# Altium project vestibular_vampire.PrjPcb (part 1 of 3)
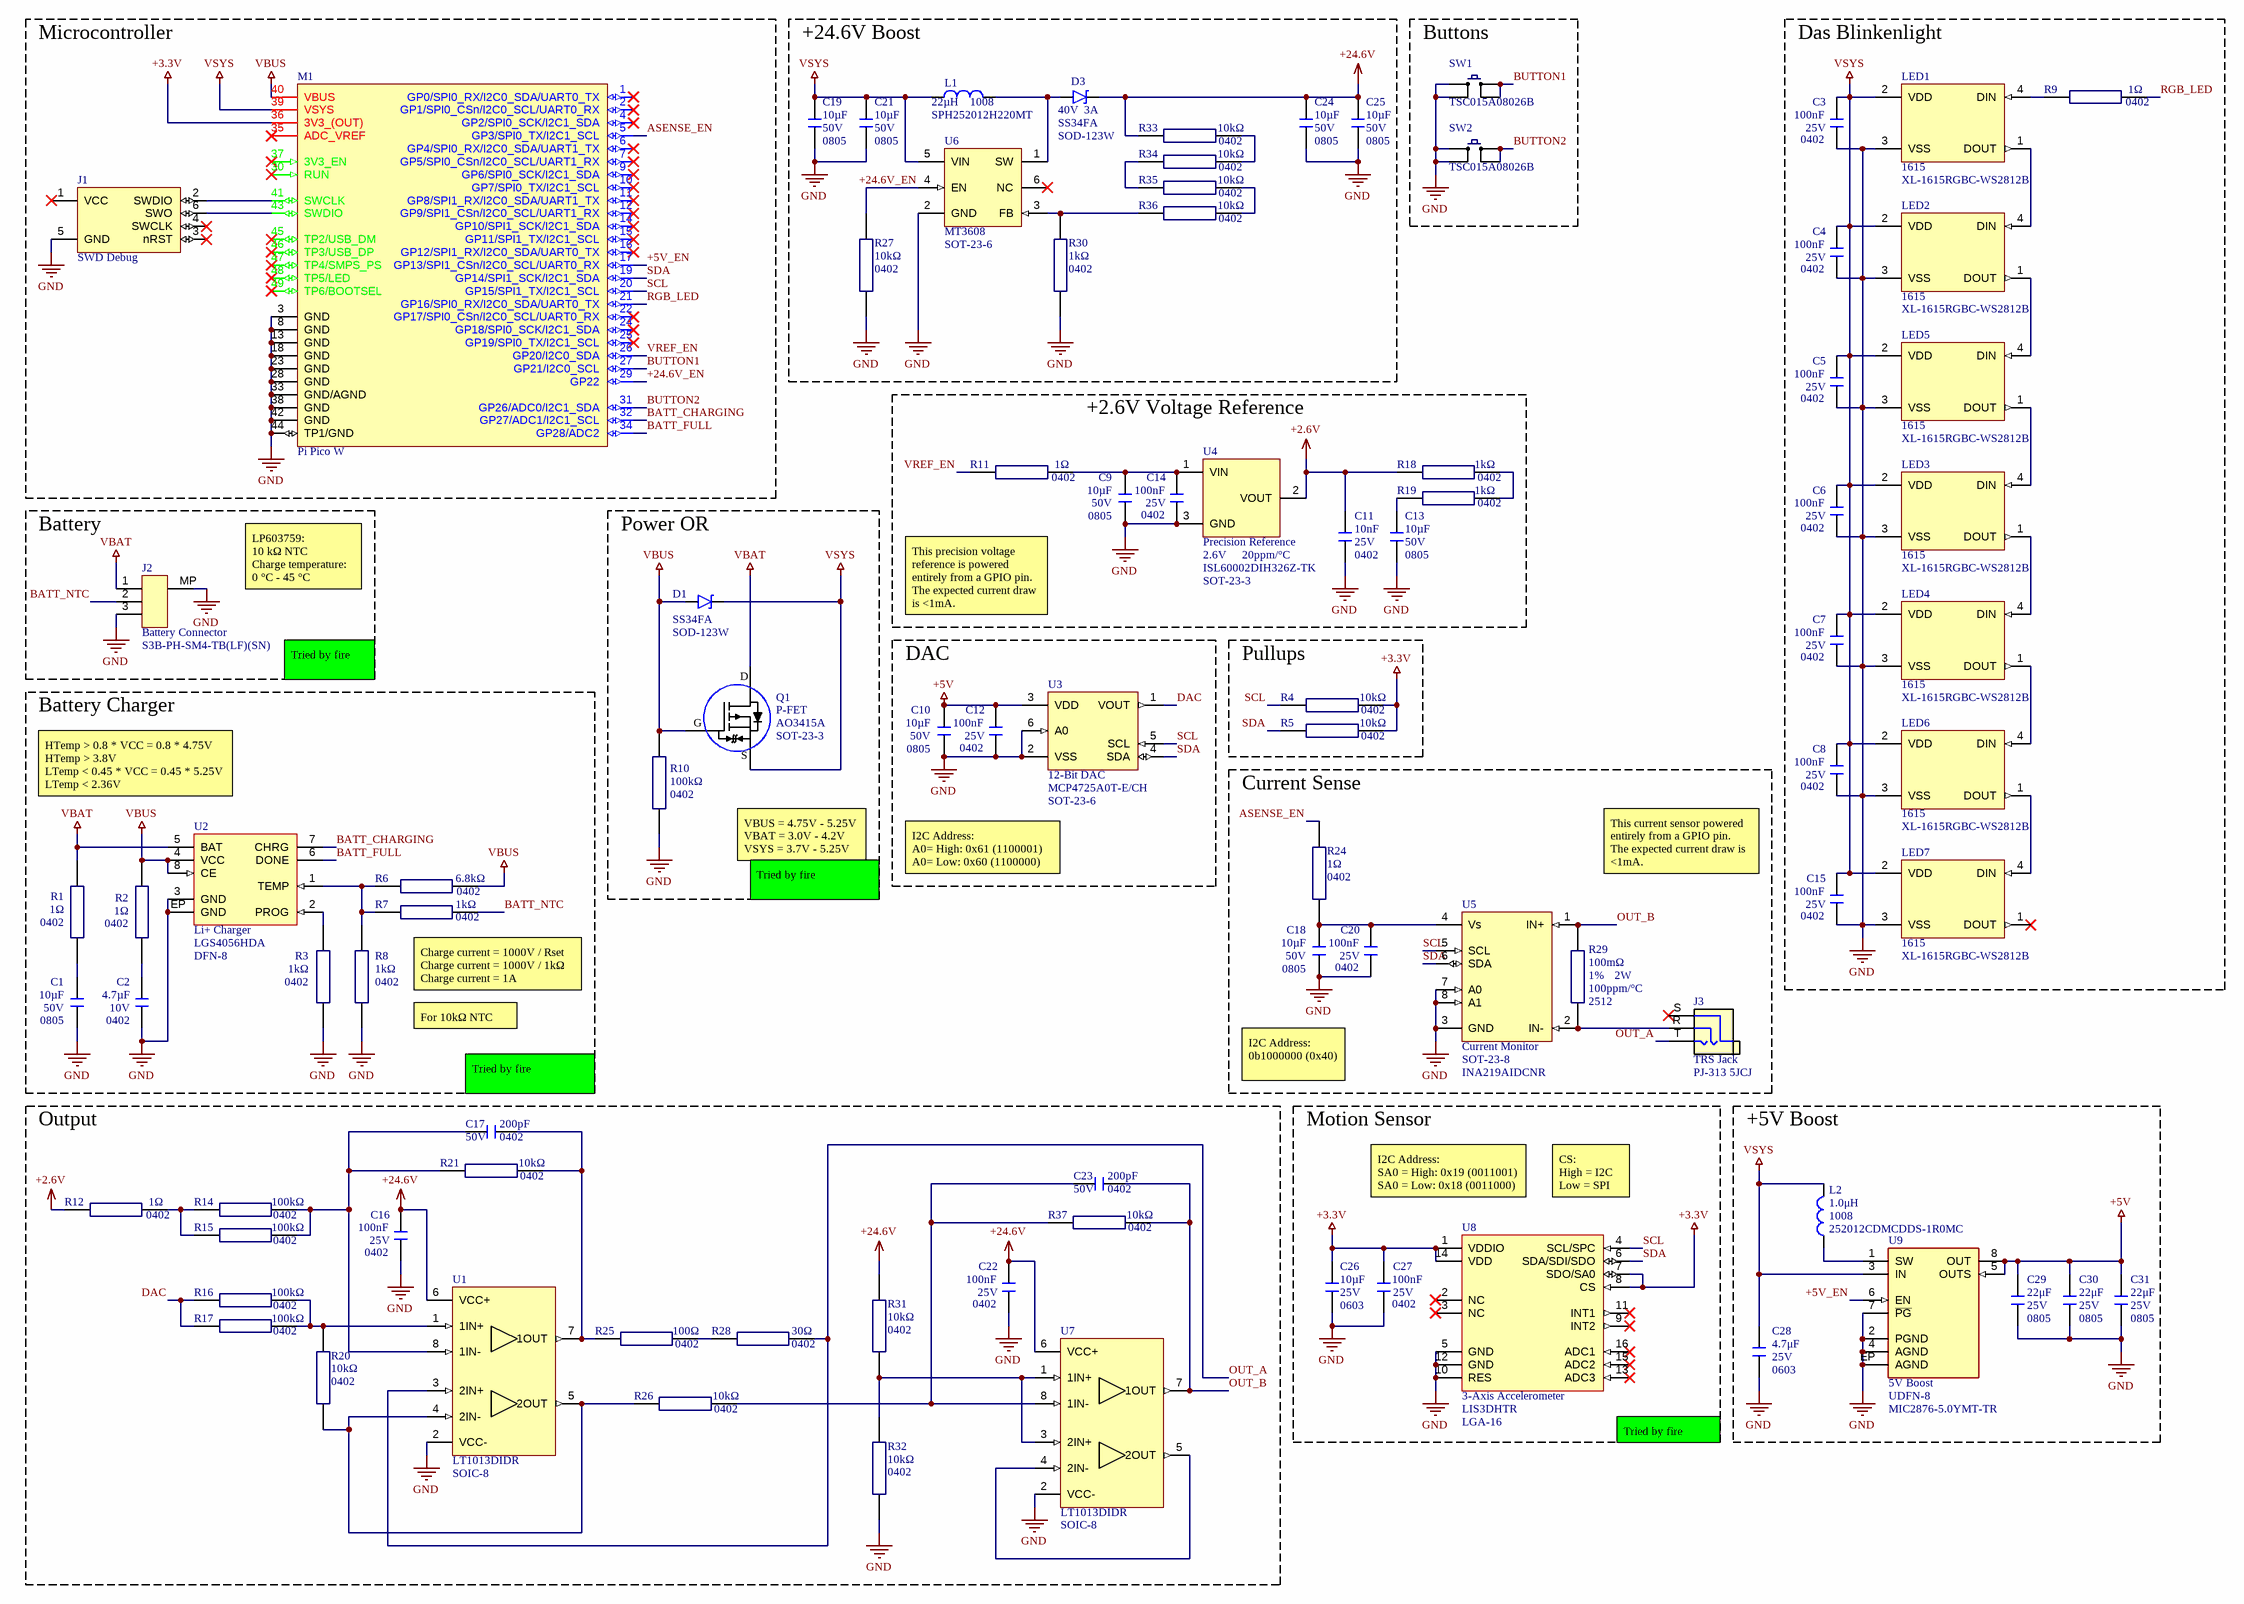
[diagram p0: vestibular_vampire.SchDoc]
Client: Entropic Engineering; Project: Vestibular Vampire; Revision: 1.0
1 sheet, 92 parts. Net scope: global (net labels, ports and power ports of the same name join across sheets).
Board file: vestibular_vampire.PcbDoc

## Sheet vestibular_vampire.SchDoc: Vestibular Vampire
size 594 x 420 mm; SheetNumber: 1; SheetTotal: 1

### Parts
C1  value 10µF  Case/Package: 0805  Voltage Rating: 50V  [0805_capacitor]  (hidden comment: GRM21BR61H106KE43L)
C2  value 4.7µF  Voltage Rating: 10V  Case/Package: 0402  [0402_capacitor]  (hidden comment: CL05A475KP5NRNC)
C3  Case Code (Imperial): 0402  Voltage: 25V  Capacitance: 100nF  [0402_capacitor]  (hidden comment: GRM155R71E104KE14D)
C4  Case Code (Imperial): 0402  Voltage: 25V  Capacitance: 100nF  [0402_capacitor]  (hidden comment: GRM155R71E104KE14D)
C5  Case Code (Imperial): 0402  Voltage: 25V  Capacitance: 100nF  [0402_capacitor]  (hidden comment: GRM155R71E104KE14D)
C6  Case Code (Imperial): 0402  Voltage: 25V  Capacitance: 100nF  [0402_capacitor]  (hidden comment: GRM155R71E104KE14D)
C7  Case Code (Imperial): 0402  Voltage: 25V  Capacitance: 100nF  [0402_capacitor]  (hidden comment: GRM155R71E104KE14D)
C8  Case Code (Imperial): 0402  Voltage: 25V  Capacitance: 100nF  [0402_capacitor]  (hidden comment: GRM155R71E104KE14D)
C9  value 10µF  Case/Package: 0805  Voltage Rating: 50V  [0805_capacitor]  (hidden comment: GRM21BR61H106KE43L)
C10  value 10µF  Case/Package: 0805  Voltage Rating: 50V  [0805_capacitor]  (hidden comment: GRM21BR61H106KE43L)
C11  Capacitance: 10nF  Voltage Rating: 25V  Case Code (Imperial): 0402  [0402_capacitor]  (hidden comment: CL05B103KA5NNNC)
C12  Case Code (Imperial): 0402  Voltage: 25V  Capacitance: 100nF  [0402_capacitor]  (hidden comment: GRM155R71E104KE14D)
C13  value 10µF  Case/Package: 0805  Voltage Rating: 50V  [0805_capacitor]  (hidden comment: GRM21BR61H106KE43L)
C14  Case Code (Imperial): 0402  Voltage: 25V  Capacitance: 100nF  [0402_capacitor]  (hidden comment: GRM155R71E104KE14D)
C15  Case Code (Imperial): 0402  Voltage: 25V  Capacitance: 100nF  [0402_capacitor]  (hidden comment: GRM155R71E104KE14D)
C16  Case Code (Imperial): 0402  Voltage: 25V  Capacitance: 100nF  [0402_capacitor]  (hidden comment: GRM155R71E104KE14D)
C17  value 200pF  Voltage Rating: 50V  Case/Package: 0402  [0402_capacitor]  (hidden comment: GRT1555C1H201FA02D)
C18  value 10µF  Case/Package: 0805  Voltage Rating: 50V  [0805_capacitor]  (hidden comment: GRM21BR61H106KE43L)
C19  value 10µF  Case/Package: 0805  Voltage Rating: 50V  [0805_capacitor]  (hidden comment: GRM21BR61H106KE43L)
C20  Case Code (Imperial): 0402  Voltage: 25V  Capacitance: 100nF  [0402_capacitor]  (hidden comment: GRM155R71E104KE14D)
C21  value 10µF  Case/Package: 0805  Voltage Rating: 50V  [0805_capacitor]  (hidden comment: GRM21BR61H106KE43L)
C22  Case Code (Imperial): 0402  Voltage: 25V  Capacitance: 100nF  [0402_capacitor]  (hidden comment: GRM155R71E104KE14D)
C23  value 200pF  Voltage Rating: 50V  Case/Package: 0402  [0402_capacitor]  (hidden comment: GRT1555C1H201FA02D)
C24  value 10µF  Case/Package: 0805  Voltage Rating: 50V  [0805_capacitor]  (hidden comment: GRM21BR61H106KE43L)
C25  value 10µF  Case/Package: 0805  Voltage Rating: 50V  [0805_capacitor]  (hidden comment: GRM21BR61H106KE43L)
C26  value 10µF  Case/Package: 0603  Voltage Rating: 25V  [0603_capacitor]  (hidden comment: CL10A106MA8NRNC)
C27  Case Code (Imperial): 0402  Voltage: 25V  Capacitance: 100nF  [0402_capacitor]  (hidden comment: GRM155R71E104KE14D)
C28  value 4.7μF  Case/Package: 0603  Voltage Rating: 25V  [0603_capacitor]  (hidden comment: C1608X5R1E475K080AC)
C29  value 22μF  Rated DC Voltage (URdc): 25V  Case/Package: 0805  [0805_capacitor]  (hidden comment: GRT21BR61E226ME13L)
C30  value 22μF  Rated DC Voltage (URdc): 25V  Case/Package: 0805  [0805_capacitor]  (hidden comment: GRT21BR61E226ME13L)
C31  value 22μF  Rated DC Voltage (URdc): 25V  Case/Package: 0805  [0805_capacitor]  (hidden comment: GRT21BR61E226ME13L)
D1  Case/Package: SOD-123W  [SOD-123]  (hidden comment: SS34FA)
D3  Average Rectified Current: 3A  Max Reverse Voltage (DC): 40V  Case/Package: SOD-123W  [SOD-123]  (hidden comment: SS34FA)
J1  SWD Debug  [debug_header_dual]  (no BOM)
J2  Battery Connector  [S3B-PH-SM4-TB]
J3  TRS Jack  [pj-313_5jcj_3.5mm_trs_jack]
L1  value 22µH  Case/Package: 1008  [INDC2520X12N]  (hidden comment: SPH252012H220MT)
L2  value 1.0μH  Package: 1008  [INDC2520X12N]  (hidden comment: 252012CDMCDDS-1R0MC)
LED1  Package: 1615  [XL-1615RGBC-WS2812B]  (hidden comment: WS2812B)
LED2  Package: 1615  [XL-1615RGBC-WS2812B]  (hidden comment: WS2812B)
LED3  Package: 1615  [XL-1615RGBC-WS2812B]  (hidden comment: WS2812B)
LED4  Package: 1615  [XL-1615RGBC-WS2812B]  (hidden comment: WS2812B)
LED5  Package: 1615  [XL-1615RGBC-WS2812B]  (hidden comment: WS2812B)
LED6  Package: 1615  [XL-1615RGBC-WS2812B]  (hidden comment: WS2812B)
LED7  Package: 1615  [XL-1615RGBC-WS2812B]  (hidden comment: WS2812B)
M1  Pi Pico W  [pi_pico_w]
Q1  P-FET  Case/Package: SOT-23-3  [SOT95P280X115-3N]
R1  value 1Ω  Case/Package: 0402  [0402_resistor]  (hidden comment: 0402WGF100KTCE)
R2  value 1Ω  Case/Package: 0402  [0402_resistor]  (hidden comment: 0402WGF100KTCE)
R3  value 1kΩ  Case/Package: 0402  [0402_resistor]  (hidden comment: Rset)
R4  value 10kΩ  Case Code (Imperial): 0402  [0402_resistor]  (hidden comment: RC0402FR-0710KL)
R5  value 10kΩ  Case Code (Imperial): 0402  [0402_resistor]  (hidden comment: RC0402FR-0710KL)
R6  value 6.8kΩ  Case/Package: 0402  [0402_resistor]  (hidden comment: RC0402FR-076K8L)
R7  value 1kΩ  Case/Package: 0402  [0402_resistor]  (hidden comment: RC0402JR-071KL)
R8  value 1kΩ  Case/Package: 0402  [0402_resistor]  (hidden comment: Rset)
R9  value 1Ω  Case/Package: 0402  [0402_resistor]  (hidden comment: 0402WGF100KTCE)
R10  value 100kΩ  Case/Package: 0402  [0402_resistor]  (hidden comment: RC0402FR-07100KL)
R11  value 1Ω  Case/Package: 0402  [0402_resistor]  (hidden comment: 0402WGF100KTCE)
R12  value 1Ω  Case/Package: 0402  [0402_resistor]  (hidden comment: 0402WGF100KTCE)
R14  value 100kΩ  Case/Package: 0402  [0402_resistor]  (hidden comment: RC0402FR-07100KL)
R15  value 100kΩ  Case/Package: 0402  [0402_resistor]  (hidden comment: RC0402FR-07100KL)
R16  value 100kΩ  Case/Package: 0402  [0402_resistor]  (hidden comment: RC0402FR-07100KL)
R17  value 100kΩ  Case/Package: 0402  [0402_resistor]  (hidden comment: RC0402FR-07100KL)
R18  value 1kΩ  Case/Package: 0402  [0402_resistor]  (hidden comment: Rset)
R19  value 1kΩ  Case/Package: 0402  [0402_resistor]  (hidden comment: Rset)
R20  value 10kΩ  Case Code (Imperial): 0402  [0402_resistor]  (hidden comment: RC0402FR-0710KL)
R21  value 10kΩ  Case Code (Imperial): 0402  [0402_resistor]  (hidden comment: RC0402FR-0710KL)
R24  value 1Ω  Case/Package: 0402  [0402_resistor]  (hidden comment: 0402WGF100KTCE)
R25  Case Code (Imperial): 0402  Resistance: 100Ω  [0402_resistor]  (hidden comment: RMCF0402FT100R)
R26  value 10kΩ  Case Code (Imperial): 0402  [0402_resistor]  (hidden comment: RC0402FR-0710KL)
R27  value 10kΩ  Case Code (Imperial): 0402  [0402_resistor]  (hidden comment: RC0402FR-0710KL)
R28  value 30Ω  Case/Package: 0402  [0402_resistor]  (hidden comment: RC0402FR-0730RL)
R29  value 100mΩ  Case/Package: 2512  Tolerance: 1%  Temperature Coefficient: 100ppm/°C  Power Dissipation: 2W  [2512_resistor]  (hidden comment: PT2512FK-7W0R1L)
R30  value 1kΩ  Case/Package: 0402  [0402_resistor]  (hidden comment: Rset)
R31  value 10kΩ  Case Code (Imperial): 0402  [0402_resistor]  (hidden comment: RC0402FR-0710KL)
R32  value 10kΩ  Case Code (Imperial): 0402  [0402_resistor]  (hidden comment: RC0402FR-0710KL)
R33  value 10kΩ  Case Code (Imperial): 0402  [0402_resistor]  (hidden comment: RC0402FR-0710KL)
R34  value 10kΩ  Case Code (Imperial): 0402  [0402_resistor]  (hidden comment: RC0402FR-0710KL)
R35  value 10kΩ  Case Code (Imperial): 0402  [0402_resistor]  (hidden comment: RC0402FR-0710KL)
R36  value 10kΩ  Case Code (Imperial): 0402  [0402_resistor]  (hidden comment: RC0402FR-0710KL)
R37  value 10kΩ  Case Code (Imperial): 0402  [0402_resistor]  (hidden comment: RC0402FR-0710KL)
SW1  TSC015A08026B  [TSC015A08026B]
SW2  TSC015A08026B  [TSC015A08026B]
U1  Case/Package: SOIC-8  [SOIC127P600X175-8N]  (hidden comment: LT1013DIDR)
U2  Li+ Charger  Manufacturer Part Number: LGS4056HDA  Package: DFN-8  [SON50P200X80_HS-9N]
U3  12-Bit DAC  Case/Package: SOT-23-6  [SOT95P280X110-6N]
U4  Precision Reference  Case/Package: SOT-23-3  Temperature Coefficient: 20ppm/°C  Reference Voltage: 2.6V  [SOT95P280X115-3N]
U5  Current Monitor  [SOT-23-8]
U6  Package: SOT-23-6  [SOT95P280X110-6N]  (hidden comment: MT3608)
U7  Case/Package: SOIC-8  [SOIC127P600X175-8N]  (hidden comment: LT1013DIDR)
U8  3-Axis Accelerometer  Case/Package: LGA-16  [LGA50P300X300X100-16N]
U9  5V Boost  Case/Package: UDFN-8  [SON50P200X50_HS-9N]

### Blocks framed on the sheet
Microcontroller: J1 M1
+24.6V Boost: C19 C21 C24 C25 D3 L1 R27 R30 R33-R36 U6
Buttons: SW1 SW2
Das Blinkenlight: C3-C8 C15 LED1-LED7 R9
+2.6V Voltage Reference: C9 C11 C13 C14 R11 R18 R19 U4
Battery: J2
Power OR: D1 Q1 R10
Battery Charger: C1 C2 R1-R3 R6-R8 U2
DAC: C10 C12 U3
Pullups: R4 R5
Current Sense: C18 C20 J3 R24 R29 U5
Output: C16 C17 C22 C23 R12 R14-R17 R20 R21 R25 R26 R28 R31 R32 R37 U1 U7
Motion Sensor: C26 C27 U8
+5V Boost: C28-C31 L2 U9

### Nets
+2.6V: C11.2 R12.2 R18.2 U4.2(VOUT)
+3.3V: C26.2 C27.2 M1.36(3V3_(OUT)) R4.2 R5.2 U8.1(VDDIO) U8.7(SDO/SA0) U8.8(CS) U8.14(VDD)
+5V: C10.2 C12.2 C29.2 C30.2 C31.2 U3.3(VDD) U9.5(OUTS) U9.8(OUT)
+24.6V: C16.2 C22.2 C24.2 C25.2 D3.K R31.1 R33.1 U1.6(VCC+) U7.6(VCC+)
GND: C1.1 C2.1 C3.1 C4.1 C5.1 C6.1 C7.1 C8.1 C9.1 C10.1 C11.1 C12.1 C13.1 C14.1 C15.1 C16.1 C18.1 C19.1 C20.1 C21.1 C22.1 C24.1 C25.1 C26.1 C27.1 C28.1 C29.1 C30.1 C31.1 J1.5(GND) J2.3 J2.MP LED1.3(VSS) LED2.3(VSS) LED3.3(VSS) LED4.3(VSS) LED5.3(VSS) LED6.3(VSS) LED7.3(VSS) M1.3(GND) M1.8(GND) M1.13(GND) M1.18(GND) M1.23(GND) M1.28(GND) M1.33(GND/AGND) M1.38(GND) M1.42(GND) M1.44(TP1/GND) R3.1 R8.1 R10.1 R27.2 R30.1 R32.2 SW1.1 SW1.2 SW2.1 SW2.2 U1.2(VCC-) U2.3(GND) U2.EP(GND) U3.2(VSS) U3.6(A0) U4.3(GND) U5.3(GND) U5.7(A0) U5.8(A1) U6.2(GND) U7.2(VCC-) U8.5(GND) U8.10(RES) U8.12(GND) U9.2(PGND) U9.4(AGND) U9.7(~{PG}) U9.EP(AGND)
VBAT: J2.1 Q1.3(D) R1.2 U2.5(BAT)
VBUS: D1.A M1.40(VBUS) Q1.1(G) R2.2 R6.1 R10.2 U2.4(VCC) U2.8(CE)
VSYS: C3.2 C4.2 C5.2 C6.2 C7.2 C8.2 C15.2 C19.2 C21.2 C28.2 D1.K L1.1 L2.1 LED1.2(VDD) LED2.2(VDD) LED3.2(VDD) LED4.2(VDD) LED5.2(VDD) LED6.2(VDD) LED7.2(VDD) M1.39(VSYS) Q1.2(S) U6.5(VIN) U9.3(IN)
+5V_EN: M1.17(GP13/SPI1_CSn/I2C0_SCL/UART0_RX) U9.6(EN)
+24.6V_EN: M1.29(GP22) R27.1 U6.4(EN)
ASENSE_EN: M1.5(GP3/SPI0_TX/I2C1_SCL) R24.2
BATT_CHARGING: M1.32(GP27/ADC1/I2C1_SCL) U2.7(CHRG)
BATT_FULL: M1.34(GP28/ADC2) U2.6(DONE)
BATT_NTC: J2.2 R7.1
BUTTON1: M1.27(GP21/I2C0_SCL) SW1.3 SW1.4
BUTTON2: M1.31(GP26/ADC0/I2C1_SDA) SW2.3 SW2.4
DAC: R16.2 R17.2 U3.1(VOUT)
OUT_A: J3.T R28.2 U1.3(2IN+)
OUT_B: C23.2 R29.1 R37.2 U5.1(IN+) U7.7(1OUT)
RGB_LED: M1.21(GP16/SPI0_RX/I2C0_SDA/UART0_TX) R9.1
SCL: M1.20(GP15/SPI1_TX/I2C1_SCL) R4.1 U3.5(SCL) U5.5(SCL) U8.4(SCL/SPC)
SDA: M1.19(GP14/SPI1_SCK/I2C1_SDA) R5.1 U3.4(SDA) U5.6(SDA) U8.6(SDA/SDI/SDO)
VREF_EN: M1.26(GP20/I2C0_SDA) R11.2
NetC1_2: C1.2 R1.1
NetC2_2: C2.2 R2.1
NetC9_2: C9.2 C14.2 R11.1 U4.1(VIN)
NetC13_2: C13.2 R19.2
NetC17_1: C17.1 R14.1 R15.1 R21.1 U1.8(1IN-)
NetC17_2: C17.2 R21.2 R25.1 U1.7(1OUT)
NetC18_2: C18.2 C20.2 R24.1 U5.4(Vs)
NetC23_1: C23.1 R26.2 R37.1 U7.8(1IN-)
NetD3_A: D3.A L1.2 U6.1(SW)
NetJ1_2: J1.2(SWDIO) M1.41(SWCLK)
NetJ1_6: J1.6(SWO) M1.43(SWDIO)
NetJ3_R: J3.R R29.2 U5.2(IN-)
NetL2_2: L2.2 U9.1(SW)
NetLED1_1: LED1.1(DOUT) LED2.4(DIN)
NetLED1_4: LED1.4(DIN) R9.2
NetLED2_1: LED2.1(DOUT) LED5.4(DIN)
NetLED3_1: LED3.1(DOUT) LED4.4(DIN)
NetLED3_4: LED3.4(DIN) LED5.1(DOUT)
NetLED4_1: LED4.1(DOUT) LED6.4(DIN)
NetLED6_1: LED6.1(DOUT) LED7.4(DIN)
NetR3_2: R3.2 U2.2(PROG)
NetR6_2: R6.2 R7.2 R8.2 U2.1(TEMP)
NetR12_1: R12.1 R14.2 R15.2
NetR16_1: R16.1 R17.1 R20.1 U1.1(1IN+)
NetR18_1: R18.1 R19.1
NetR20_2: R20.2 R26.1 U1.4(2IN-) U1.5(2OUT)
NetR25_2: R25.2 R28.1
NetR30_2: R30.2 R36.1 U6.3(FB)
NetR31_2: R31.2 R32.1 U7.1(1IN+) U7.3(2IN+)
NetR33_2: R33.2 R34.2
NetR34_1: R34.1 R35.1
NetR35_2: R35.2 R36.2
NetU7_4: U7.4(2IN-) U7.5(2OUT)

Not connected (* = marked no-connect by the designer): J1 1(VCC)* 3(nRST)* 4(SWCLK)*; J3 S*; LED7 1(DOUT)*; M1 1(GP0/SPI0_RX/I2C0_SDA/UART0_TX)* 2(GP1/SPI0_CSn/I2C0_SCL/UART0_RX)* 4(GP2/SPI0_SCK/I2C1_SDA)* 6(GP4/SPI0_RX/I2C0_SDA/UART1_TX)* 7(GP5/SPI0_CSn/I2C0_SCL/UART1_RX)* 9(GP6/SPI0_SCK/I2C1_SDA)* 10(GP7/SPI0_TX/I2C1_SCL)* 11(GP8/SPI1_RX/I2C0_SDA/UART1_TX)* 12(GP9/SPI1_CSn/I2C0_SCL/UART1_RX)* 14(GP10/SPI1_SCK/I2C1_SDA)* 15(GP11/SPI1_TX/I2C1_SCL)* 16(GP12/SPI1_RX/I2C0_SDA/UART0_TX)* 22(GP17/SPI0_CSn/I2C0_SCL/UART0_RX)* 24(GP18/SPI0_SCK/I2C1_SDA)* 25(GP19/SPI0_TX/I2C1_SCL)* 30(RUN)* 35(ADC_VREF)* 37(3V3_EN)* 45(TP2/USB_DM)* 46(TP3/USB_DP)* 47(TP4/SMPS_PS)* 48(TP5/LED)* 49(TP6/BOOTSEL)*; U6 6(NC)*; U8 2(NC)* 3(NC)* 9(INT2)* 11(INT1)* 13(ADC3)* 15(ADC2)* 16(ADC1)*

### Notes on the sheet
- LP603759:
  10 kΩ NTC
  Charge temperature:
  0 °C - 45 °C
- This precision voltage reference is powered entirely from a GPIO pin.  The expected current draw is <1mA.
- Tried by fire
- HTemp > 0.8 * VCC = 0.8 * 4.75V
  HTemp > 3.8V
  LTemp < 0.45 * VCC = 0.45 * 5.25V
  LTemp < 2.36V
- VBUS = 4.75V - 5.25V
  VBAT = 3.0V - 4.2V
  VSYS = 3.7V - 5.25V
- I2C Address:
  A0= High: 0x61 (1100001)
  A0= Low: 0x60 (1100000)
- This current sensor powered entirely from a GPIO pin.  The expected current draw is <1mA.
- For 10kΩ NTC
- (near R7) Charge current = 1000V / Rset
  Charge current = 1000V / 1kΩ
  Charge current = 1A
- (near C17) Tried by fire
- I2C Address:
  0b1000000 (0x40)
- I2C Address:
  SA0 = High: 0x19 (0011001)
  SA0 = Low: 0x18 (0011000)
- CS:
  High = I2C
  Low = SPI
- (near U8) Tried by fire
- 670 Transfer Road
- St. Paul, MN 55114
- Sheet Title:
- Project:
- CONFIDENTIAL - NOT FOR RELEASE UNLESS AUTHORIZED
- USA
- Client:
- Filename:
- Date:
- Revision:
- Sheet:
- of
- A2